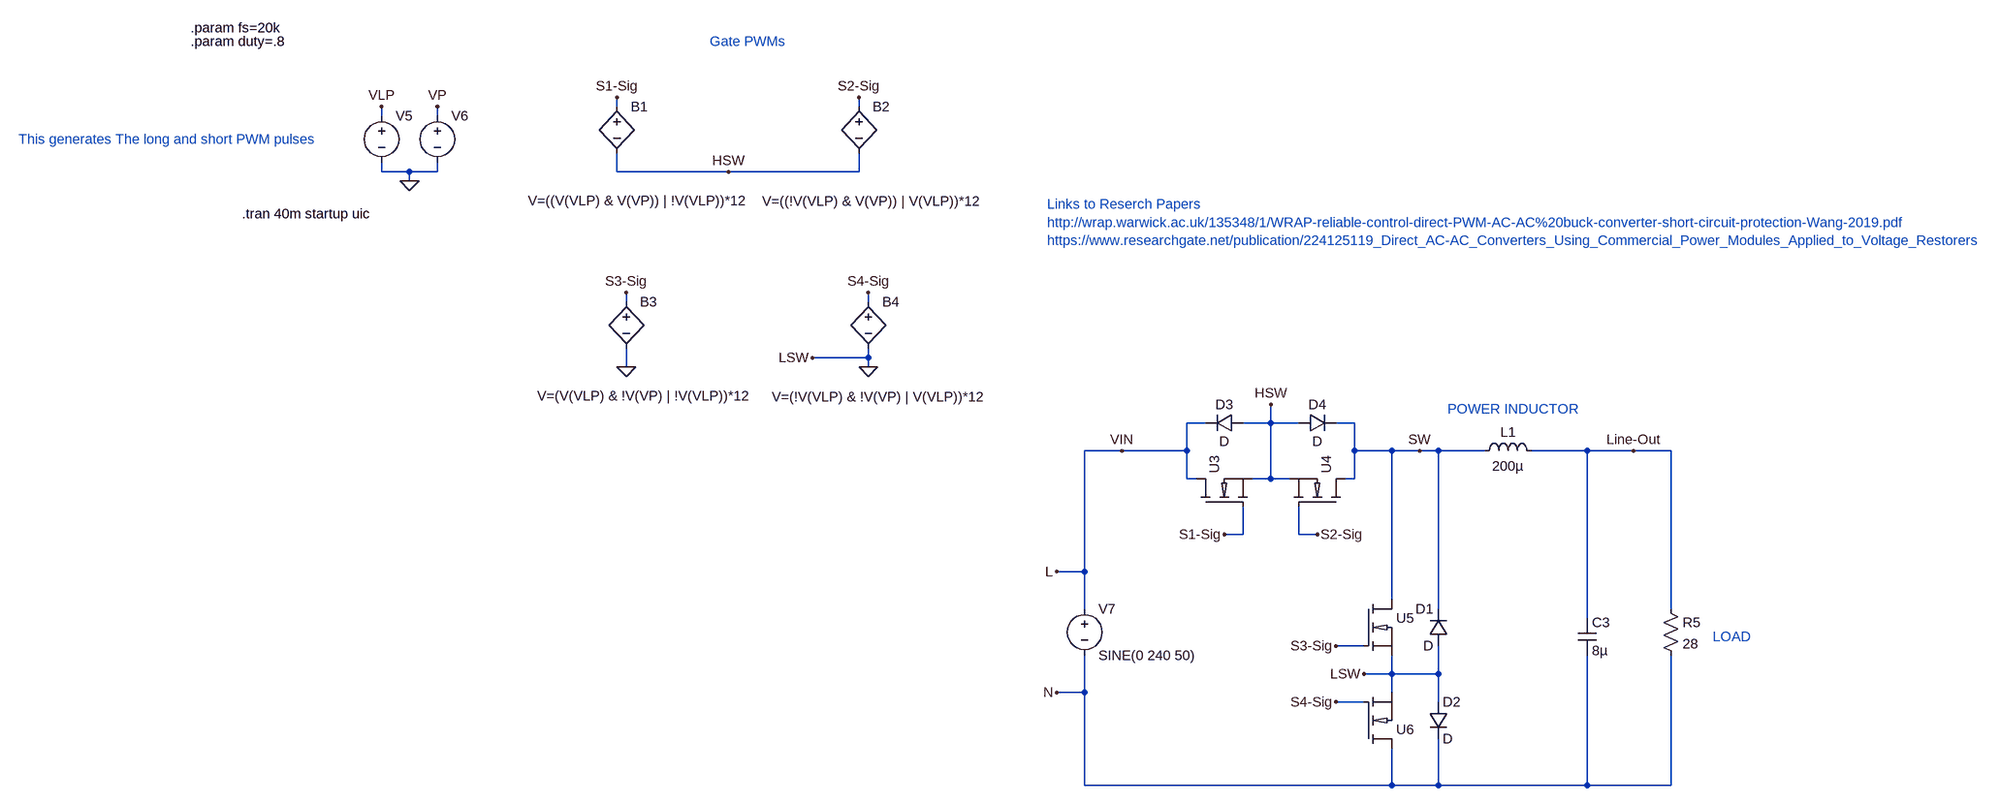
[diagram p0: schematic AC-AC-Buck-Voltage-Source-Control.asc]
AC-AC-Buck-Voltage-Source-Control.asc, the LTspice schematic file:
Version 4
SHEET 1 4368 680
WIRE 1728 -816 1728 -832
WIRE 2144 -816 2144 -832
WIRE 1200 -800 1200 -816
WIRE 1296 -800 1296 -816
WIRE 1200 -704 1200 -720
WIRE 1248 -704 1200 -704
WIRE 1296 -704 1296 -720
WIRE 1296 -704 1248 -704
WIRE 1728 -704 1728 -736
WIRE 1920 -704 1728 -704
WIRE 2144 -704 2144 -736
WIRE 2144 -704 1920 -704
WIRE 1248 -688 1248 -704
WIRE 1744 -480 1744 -496
WIRE 2160 -480 2160 -496
WIRE 2160 -384 2160 -400
WIRE 2160 -384 2064 -384
WIRE 1744 -368 1744 -400
WIRE 2160 -368 2160 -384
WIRE 2880 -272 2848 -272
WIRE 2992 -272 2992 -304
WIRE 2992 -272 2944 -272
WIRE 3040 -272 2992 -272
WIRE 3136 -272 3104 -272
WIRE 2736 -224 2672 -224
WIRE 2848 -224 2848 -272
WIRE 2848 -224 2736 -224
WIRE 3136 -224 3136 -272
WIRE 3200 -224 3136 -224
WIRE 3248 -224 3200 -224
WIRE 3280 -224 3248 -224
WIRE 3360 -224 3280 -224
WIRE 3536 -224 3440 -224
WIRE 3616 -224 3536 -224
WIRE 3680 -224 3616 -224
WIRE 2848 -176 2848 -224
WIRE 2864 -176 2848 -176
WIRE 2992 -176 2992 -272
WIRE 2992 -176 2960 -176
WIRE 3024 -176 2992 -176
WIRE 3136 -176 3136 -224
WIRE 3136 -176 3120 -176
WIRE 2944 -80 2944 -128
WIRE 2944 -80 2912 -80
WIRE 3040 -80 3040 -128
WIRE 3072 -80 3040 -80
WIRE 2672 -16 2672 -224
WIRE 2672 -16 2624 -16
WIRE 3200 32 3200 -224
WIRE 2672 48 2672 -16
WIRE 3280 48 3280 -224
WIRE 3680 48 3680 -224
WIRE 3536 64 3536 -224
WIRE 3152 112 3104 112
WIRE 3200 160 3200 128
WIRE 3200 160 3152 160
WIRE 3280 160 3280 112
WIRE 3280 160 3200 160
WIRE 2672 192 2672 128
WIRE 2672 192 2624 192
WIRE 3200 192 3200 160
WIRE 3152 208 3104 208
WIRE 3280 208 3280 160
WIRE 2672 352 2672 192
WIRE 3200 352 3200 288
WIRE 3200 352 2672 352
WIRE 3280 352 3280 272
WIRE 3280 352 3200 352
WIRE 3536 352 3536 128
WIRE 3536 352 3280 352
WIRE 3680 352 3680 128
WIRE 3680 352 3536 352
FLAG 1296 -816 VP
FLAG 1200 -816 VLP
FLAG 1248 -688 0
FLAG 1728 -832 S1-Sig
FLAG 2144 -832 S2-Sig
FLAG 1744 -496 S3-Sig
FLAG 2160 -368 0
FLAG 2160 -496 S4-Sig
FLAG 1744 -368 0
FLAG 1920 -704 HSW
FLAG 3248 -224 SW
FLAG 2624 -16 L
FLAG 2624 192 N
FLAG 2992 -304 HSW
FLAG 3072 -80 S2-Sig
FLAG 2912 -80 S1-Sig
FLAG 3104 208 S4-Sig
FLAG 3104 112 S3-Sig
FLAG 3152 160 LSW
FLAG 2064 -384 LSW
FLAG 2736 -224 VIN
FLAG 3616 -224 Line-Out
SYMBOL voltage 1200 -816 R0
WINDOW 3 -41 188 Invisible 2
WINDOW 123 0 0 Left 0
WINDOW 39 0 0 Left 0
SYMATTR Value PULSE(0 1 0 1n 1n 10m 20m)
SYMATTR InstName V5
SYMBOL voltage 1296 -816 R0
WINDOW 3 43 180 Invisible 2
WINDOW 123 0 0 Left 0
WINDOW 39 0 0 Left 0
SYMATTR Value PULSE(0 1 0 1n 1n {pow(fs, -1)*duty} {pow(fs, -1)})
SYMATTR InstName V6
SYMBOL bv 1728 -832 R0
WINDOW 3 -153 178 Left 2
SYMATTR Value V=((V(VLP) & V(VP)) | !V(VLP))*12
SYMATTR InstName B1
SYMBOL bv 2144 -832 R0
WINDOW 3 -166 179 Left 2
SYMATTR Value V=((!V(VLP) & V(VP)) | V(VLP))*12
SYMATTR InstName B2
SYMBOL bv 1744 -496 R0
WINDOW 3 -153 178 Left 2
SYMATTR Value V=(V(VLP) & !V(VP) | !V(VLP))*12
SYMATTR InstName B3
SYMBOL bv 2160 -496 R0
WINDOW 3 -166 179 Left 2
SYMATTR Value V=(!V(VLP) & !V(VP) | V(VLP))*12
SYMATTR InstName B4
SYMBOL AutoGenerated\\irfp460n 2864 -128 R270
WINDOW 3 196 41 Invisible 2
SYMATTR InstName U3
SYMBOL AutoGenerated\\irfp460n 3120 -128 M270
WINDOW 3 194 52 Invisible 2
SYMATTR InstName U4
SYMBOL AutoGenerated\\irfp460n 3152 32 R0
WINDOW 3 169 53 Invisible 2
SYMATTR InstName U5
SYMBOL AutoGenerated\\irfp460n 3152 288 M180
WINDOW 3 178 49 Invisible 2
SYMATTR InstName U6
SYMBOL diode 3296 112 R180
WINDOW 0 24 64 Left 2
WINDOW 3 24 0 Left 2
SYMATTR InstName D1
SYMBOL diode 3264 208 R0
SYMATTR InstName D2
SYMBOL diode 2944 -288 R90
WINDOW 0 0 32 VBottom 2
WINDOW 3 32 32 VTop 2
SYMATTR InstName D3
SYMBOL diode 3040 -256 R270
WINDOW 0 32 32 VTop 2
WINDOW 3 0 32 VBottom 2
SYMATTR InstName D4
SYMBOL voltage 2672 32 R0
WINDOW 123 0 0 Left 0
WINDOW 39 0 0 Left 0
SYMATTR InstName V7
SYMATTR Value SINE(0 240 50)
SYMBOL res 3664 32 R0
SYMATTR InstName R5
SYMATTR Value 28
SYMBOL cap 3520 64 R0
SYMATTR InstName C3
SYMATTR Value 8µ
SYMBOL ind 3344 -208 R270
WINDOW 0 32 56 VTop 2
WINDOW 3 5 56 VBottom 2
SYMATTR InstName L1
SYMATTR Value 200µ
TEXT 960 -632 Left 2 !.tran 40m startup uic
TEXT 872 -952 Left 2 !.param fs=20k
TEXT 872 -928 Left 2 !.param duty=.8
TEXT 576 -760 Left 2 ;This generates The long and short PWM pulses
TEXT 1888 -928 Left 2 ;Gate PWMs
TEXT 2608 -648 Left 2 ;Links to Reserch Papers\nhttp://wrap.warwick.ac.uk/135348/1/WRAP-reliable-control-direct-PWM-AC-AC%20buck-converter-short-circuit-protection-Wang-2019.pdf\nhttps://www.researchgate.net/publication/224125119_Direct_AC-AC_Converters_Using_Commercial_Power_Modules_Applied_to_Voltage_Restorers
TEXT 3752 96 Left 2 ;LOAD
TEXT 3296 -296 Left 2 ;POWER INDUCTOR

The netlist it stands for:
* AC-AC-Buck-Voltage-Source-Control.asc
V5 VLP 0 PULSE(0 1 0 1n 1n 10m 20m)
V6 VP 0 PULSE(0 1 0 1n 1n {pow(fs, -1)*duty} {pow(fs, -1)})
B1 S1-Sig HSW V=((V(VLP) & V(VP)) | !V(VLP))*12
B2 S2-Sig HSW V=((!V(VLP) & V(VP)) | V(VLP))*12
B3 S3-Sig 0 V=(V(VLP) & !V(VP) | !V(VLP))*12
B4 S4-Sig 0 V=(!V(VLP) & !V(VP) | V(VLP))*12
XU3 VIN S1-Sig HSW irfp460n  ; pins D G S
XU4 SW S2-Sig HSW irfp460n  ; pins D G S
XU5 SW S3-Sig 0 irfp460n  ; pins D G S
XU6 N S4-Sig 0 irfp460n  ; pins D G S
D1 0 SW D
D2 0 N D
D3 HSW VIN D
D4 HSW SW D
V7 VIN N SINE(0 240 50)
R5 Line-Out N 28
C3 Line-Out N 8µ
L1 SW Line-Out 200µ
.model D D
.lib standard.dio
.tran 40m startup uic
.param fs=20k
.param duty=.8
* This generates The long and short PWM pulses
* Gate PWMs
* Links to Reserch Papers
* http://wrap.warwick.ac.uk/135348/1/WRAP-reliable-control-direct-PWM-AC-AC%20buck-converter-short-circuit-protection-Wang-2019.pdf
* https://www.researchgate.net/publication/224125119_Direct_AC-AC_Converters_Using_Commercial_Power_Modules_Applied_to_Voltage_Restorers
* LOAD
* POWER INDUCTOR
.lib "irfp460n.lib"
.backanno
.end